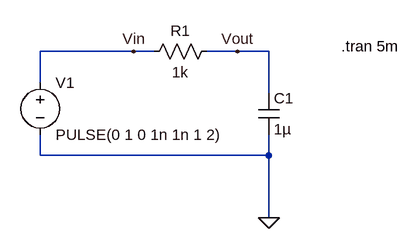
[diagram p0: schematic Transient Simulation with RC Circuit.asc]
Transient Simulation with RC Circuit.asc, the LTspice schematic file:
Version 4
SHEET 1 880 680
WIRE 144 64 0 64
WIRE 176 64 144 64
WIRE 304 64 256 64
WIRE 352 64 304 64
WIRE 0 112 0 64
WIRE 352 128 352 64
WIRE 0 224 0 192
WIRE 352 224 352 192
WIRE 352 224 0 224
WIRE 352 320 352 224
FLAG 352 320 0
FLAG 144 64 Vin
FLAG 304 64 Vout
SYMBOL cap 336 128 R0
SYMATTR InstName C1
SYMATTR Value 1µ
SYMBOL res 272 48 R90
WINDOW 0 0 56 VBottom 2
WINDOW 3 32 56 VTop 2
SYMATTR InstName R1
SYMATTR Value 1k
SYMBOL voltage 0 96 R0
WINDOW 123 0 0 Left 0
WINDOW 39 0 0 Left 0
SYMATTR InstName V1
SYMATTR Value PULSE(0 1 0 1n 1n 1 2)
TEXT 464 56 Left 2 !.tran 5m

The netlist it stands for:
* Transient Simulation with RC Circuit.asc
C1 Vout 0 1µ
R1 Vout Vin 1k
V1 Vin 0 PULSE(0 1 0 1n 1n 1 2)
.tran 5m
.backanno
.end